# EasyEDA Pro project Summer Robot.eprj, schematic Schematic2
Board Name: Non-Inductive Driver; Create Date: 2026-06-13; Page Name: P1; Project Name: Summer Robot; Schematic Name: Schematic2; Update Date: 2026-06-13; Company: EasyEDA.com; Page Size: A4; Version: V1.0
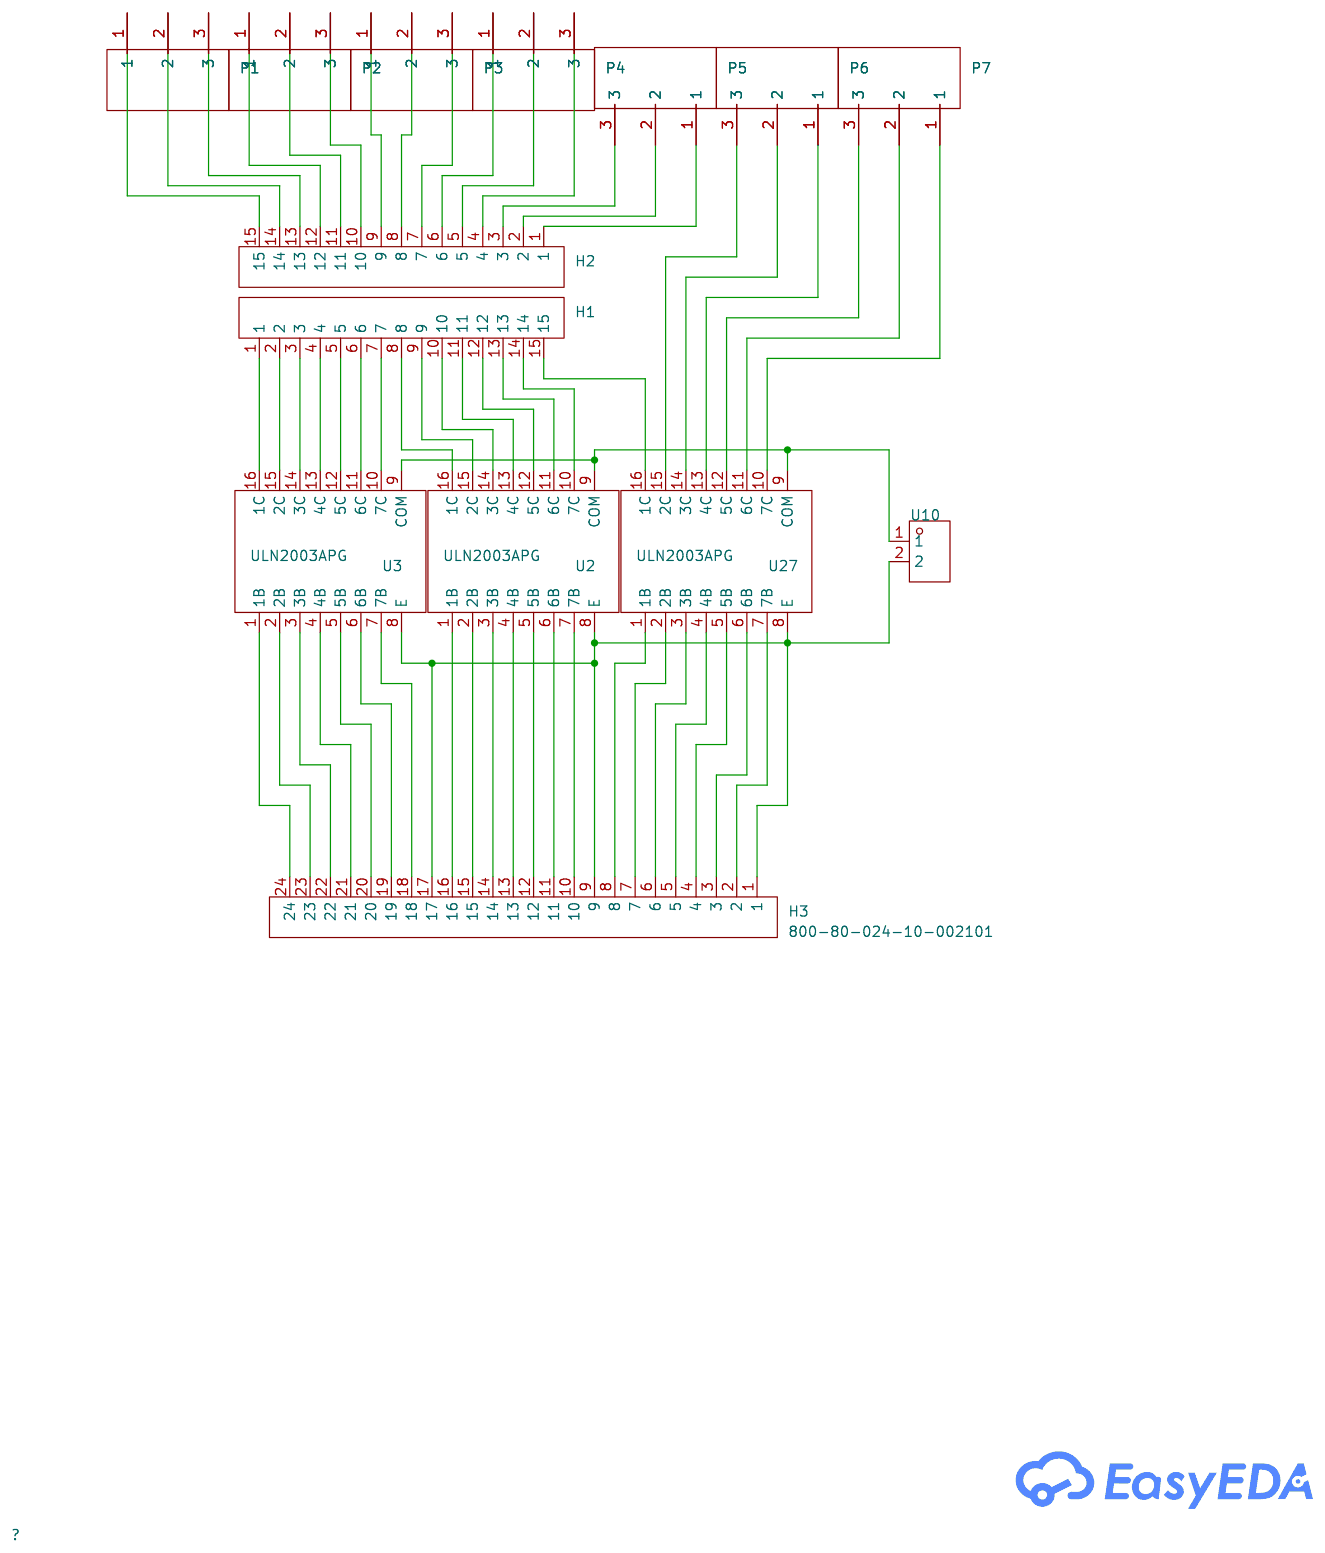
[diagram p8: schematic sheet]

## Parts
H1  316-83-115-41-008101  [HDR-TH_15P-P2.54-V-F-1]
H2  316-83-115-41-008101  [HDR-TH_15P-P2.54-V-F-1]
H3  800-80-024-10-002101  [HDR-TH_24P-P2.54-V-M_1]
P1  WJ126V-5.0-03P-14-00A  [CONN-TH_3P-P5.00_WJ126V-5.0-3P]
P2  WJ126V-5.0-03P-14-00A  [CONN-TH_3P-P5.00_WJ126V-5.0-3P]
P3  WJ126V-5.0-03P-14-00A  [CONN-TH_3P-P5.00_WJ126V-5.0-3P]
P4  WJ126V-5.0-03P-14-00A  [CONN-TH_3P-P5.00_WJ126V-5.0-3P]
P5  WJ126V-5.0-03P-14-00A  [CONN-TH_3P-P5.00_WJ126V-5.0-3P]
P6  WJ126V-5.0-03P-14-00A  [CONN-TH_3P-P5.00_WJ126V-5.0-3P]
P7  WJ126V-5.0-03P-14-00A  [CONN-TH_3P-P5.00_WJ126V-5.0-3P]
U2  ULN2003APG  [DIP-16_L19.2-W6.6-P2.54-LS7.6-BL]
U3  ULN2003APG  [DIP-16_L19.2-W6.6-P2.54-LS7.6-BL]
U10  WJ126V-5.0-2P-16-00A  [CONN-TH_WJ126V-5.0-2P]
U27  ULN2003APG  [DIP-16_L19.2-W6.6-P2.54-LS7.6-BL]

## Library data of the parts
H1 H2 = 316-83-115-41-008101: Pitch:2.54mm Mounting Type:Through Hole Number of Rows:1 Number of Positions:15P Current Rating:3A Insulation Height:12mm Contact Plating:Tin Operating Temperature:-55℃~+125℃ Operating Temperature:-55℃~+125℃; LCSC Part Name: 间距:2.54mm 直插; Supplier Part: C6406013; Manufacturer: Preci-Dip; Supplier Footprint: 插件,P=2.54mm; JLCPCB Part Class: Extended Part; Datasheet: https://item.szlcsc.com/datasheet/316-83-115-41-008101/7357323.html; Supplier: LCSC; Pitch: 2.54mm; Mounting Type: Through Hole; Number of Rows: 1; Number of Positions: 15P; Current Rating: 3A; Insulation Height: 12mm; Contact Plating: Tin; Operating Temperature: -55℃~+125℃
H3 = 800-80-024-10-002101: LCSC Part Name: 间距:2.54mm 直插; Supplier Part: C6709099; Manufacturer: Preci-Dip; Supplier Footprint: 插件,P=2.54mm; JLCPCB Part Class: Extended Part; Datasheet: https://item.szlcsc.com/datasheet/800-80-024-10-002101/7666139.html; Supplier: LCSC; Pitch: 2.54mm; Mounting Type: Through Hole; Number of Rows: 1; Number of Pins: 24P; Current Rating: 3A; Voltage Rating (Max): 150V; Contact Material: Brass; Contact Plating: Tin; Operating Temperature: -55℃~+125℃; Color: Black
P1-P7 = WJ126V-5.0-03P-14-00A: LCSC Part Name: 1x3P 5mm 直插 排数:1 每排P数:3; Supplier Part: C8401; Manufacturer: KANGNEX(康奈克斯电气); Supplier Footprint: 插件,P=5mm; JLCPCB Part Class: Extended Part; Datasheet: https://item.szlcsc.com/datasheet/WJ126V-5.0-03P-14-00A/8895.html; Supplier: LCSC; Number of Positions or Pins: 1x3P; Pitch: 5mm; Color: Green; Mounting Type: Through Hole; Number of Pins: 3P; Number of Rows: 1; Number of PINs Per Row: 3; Current Rating: 18A; Voltage Rating (Max): 250V; Wire Gauge - AWG: 14~26; Wire Gauge - mm2: 2.5; Operating Temperature: -40℃~+105℃
U2 U3 U27 = ULN2003APG: LCSC Part Name: 停产 ULN2003APG; Supplier Part: C5251; Manufacturer: TOSHIBA(东芝); Supplier Footprint: DIP-16; JLCPCB Part Class: Extended Part; Datasheet: https://atta.szlcsc.com/upload/public/pdf/source/20120402/1457706461278.pdf; Supplier: LCSC; number of channels: Seven channels
U10 = WJ126V-5.0-2P-16-00A: LCSC Part Name: 直插式/5.0mm 2P 红色; Supplier Part: C3031437; Manufacturer: KANGNEX(康奈克斯电气); Supplier Footprint: P=5mm; JLCPCB Part Class: Extended Part; Datasheet: https://atta.szlcsc.com/upload/public/pdf/source/20191225/C8379_3D37D98EF6F0ECCD8D2EB72C93E46299.pdf; Supplier: LCSC

## Nets
$1N767: H3.24 U3.1(1B)
$1N769: H3.23 U3.2(2B)
$1N771: H3.22 U3.3(3B)
$1N773: H3.21 U3.4(4B)
$1N775: H3.20 U3.5(5B)
$1N779: H3.18 U3.7(7B)
$1N1937: U2.9(COM) U3.9(COM) U10.1 U27.9(COM)
$1N2778: H1.1 U3.16(1C)
$1N2782: H1.2 U3.15(2C)
$1N2793: H1.3 U3.14(3C)
$1N2797: H1.4 U3.13(4C)
$1N2802: H1.5 U3.12(5C)
$1N2807: H1.6 U3.11(6C)
$1N2812: H1.7 U3.10(7C)
$1N2817: H1.8 U2.16(1C)
$1N2822: H1.9 U2.15(2C)
$1N2827: H1.10 U2.14(3C)
$1N2832: H1.11 U2.13(4C)
$1N2837: H1.12 U2.12(5C)
$1N2842: H1.13 U2.11(6C)
$1N2847: H1.14 U2.10(7C)
$1N3067: H2.15 P1.1
$1N3071: H2.14 P1.2
$1N3076: H2.13 P1.3
$1N3081: H2.12 P2.1
$1N3086: H2.11 P2.2
$1N3091: H2.10 P2.3
$1N3096: H2.9 P3.1
$1N3101: H2.8 P3.2
$1N3106: H2.7 P3.3
$1N3111: H2.6 P4.1
$1N3116: H2.5 P4.2
$1N3121: H2.4 P4.3
$1N3126: H2.3 P5.3
$1N3131: H2.2 P5.2
$1N3215: H3.1 H3.9 H3.17 U2.8(E) U3.8(E) U10.2 U27.8(E)
$1N3218: H3.19 U3.6(6B)
$1N5310: P7.1 U27.10(7C)
$1N5316: P7.2 U27.11(6C)
$1N5323: P7.3 U27.12(5C)
$1N5330: P6.1 U27.13(4C)
$1N5337: P6.2 U27.14(3C)
$1N5343: P6.3 U27.15(2C)
$1N5516: H2.1 P5.1
$1N5641: H1.15 U27.16(1C)
$1N5762: H3.8 U27.1(1B)
$1N5798: H3.7 U27.2(2B)
$1N5810: H3.6 U27.3(3B)
$1N5816: H3.5 U27.4(4B)
$1N5822: H3.4 U27.5(5B)
$1N5828: H3.3 U27.6(6B)
$1N5834: H3.2 U27.7(7B)
$1N6608: H3.16 U2.1(1B)
$1N6612: H3.15 U2.2(2B)
$1N6617: H3.14 U2.3(3B)
$1N6642: H3.13 U2.4(4B)
$1N6647: H3.12 U2.5(5B)
$1N6660: H3.11 U2.6(6B)
$1N6665: H3.10 U2.7(7B)
